# EAGLE design automatic streetlight with LDR (EAGLE 7.2.0)
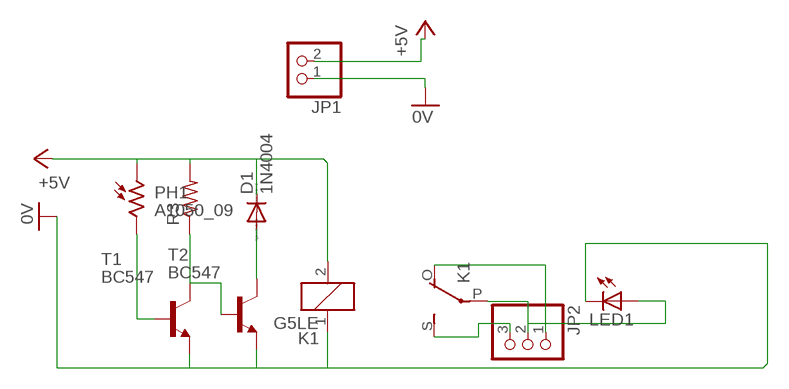
[diagram p0: schematic, sheet 1]

## Parts
D1  1N4004  [DO41-10]
JP1  PINHD-1X2  [1X02]
JP2  PINHD-1X3  [1X03]
K1  G5LE  [G5LE]
LED1  LED3MM  [LED3MM]
PH1  A1050_09  [T0-46-A10XX]
R3  R-US_0207/10  [0207/10]
T1  BC547  [TO92]
T2  BC547  [TO92]

## Nets
0V: JP1.1 K1.1 LED1.K(C) T1.1(E) T2.1(E)
+5V: D1.C JP1.2 K1.2 PH1.1 R3.2
N$2: PH1.2 T1.2(B)
N$3: JP2.2 K1.P(2:P) LED1.A
N$5: JP2.1 K1.O(2:O)
N$6: JP2.3 K1.S(2:S)
N$7: R3.1 T1.3(C) T2.2(B)
N$8: D1.A T2.3(C)

## Library data of the parts
D1 = diode:1N4004: DIODE general purpose rectifier, 1 A
JP1 = pinhead:PINHD-1X2: PIN HEADER
JP2 = pinhead:PINHD-1X3: PIN HEADER
K1 = relay:G5LE: RELAY 1 x switch, 10 A/120 V AC, 8 A/30 V DC, Omron; OC_FARNELL: unknown; OC_NEWARK: unknown
LED1 = led:LED: LED OSRAM: - CHIPLED LG R971, LG N971, LY N971, LG Q971, LY Q971, LO R971, LY R971 LH N974, LH R974 LS Q976, LO Q976, LY Q976 LO Q996 - Hyper CHIPLED LW Q18S LB Q993, LB Q99A, LB R99A - SideLED LS A670, LO A670, LY A670, LG A670, LP A670 LB A673, LV A673, LT A673, LW A673 LH A674 LY A675 LS A676, LA A676, LO A676, LY A676, LW A676 LS A679, LY A679, LG A679 - Hyper Micro SIDELED® LS Y876, LA Y876, LO Y876, LY Y876 LT Y87S - SmartLED LW L88C, LW L88S LB L89C, LB L89S, LG L890 LS L89K, LO L89K, LY L89K LS L896, LA L896, LO L896, LY L896 - TOPLED LS T670, LO T670, LY T670, LG T670, LP T670 LSG T670, LSP T670, LSY T670, LOP T670, LYG T670 LG T671, LOG T671, LSG T671 LB T673, LV T673, LT T673, LW T673 LH T674 LS T676, LA T676, LO T676, LY T676, LB T676, LH T676, LSB T676, LW T676 LB T67C, LV T67C, LT T67C, LS T67K, LO T67K, LY T67K, LW E67C LS E67B, LA E67B, LO E67B, LY E67B, LB E67C, LV E67C, LT E67C LW T67C LS T679, LY T679, LG T679 LS T770, LO T770, LY T770, LG T770, LP T770 LB T773, LV T773, LT T773, LW T773 LH T774 LS E675, LA E675, LY E675, LS T675 LS T776, LA T776, LO T776, LY T776, LB T776 LHGB T686 LT T68C, LB T68C - Hyper Mini TOPLED® LB M676 - Mini TOPLED Santana® LG M470 LS M47K, LO M47K, LY M47K Source: http://www.osram.convergy.de LUXEON: - LUMILED® LXK2-PW12-R00, LXK2-PW12-S00, LXK2-PW14-U00, LXK2-PW14-V00 LXK2-PM12-R00, LXK2-PM12-S00, LXK2-PM14-U00 LXK2-PE12-Q00, LXK2-PE12-R00, LXK2-PE12-S00, LXK2-PE14-T00, LXK2-PE14-U00 LXK2-PB12-K00, LXK2-PB12-L00, LXK2-PB12-M00, LXK2-PB14-N00, LXK2-PB14-P00, LXK2-PB14-Q00 LXK2-PR12-L00, LXK2-PR12-M00, LXK2-PR14-Q00, LXK2-PR14-R00 LXK2-PD12-Q00, LXK2-PD12-R00, LXK2-PD12-S00 LXK2-PH12-R00, LXK2-PH12-S00 LXK2-PL12-P00, LXK2-PL12-Q00, LXK2-PL12-R00 Source: www.luxeon.com KINGBRIGHT: KA-3528ASYC Source: www.kingbright.com
PH1 = photo-elements:A10: Sensor Robust Light Sensing Applications Outdoor Light Sensing Application Source: http://optoelectronics.perkinelmer.com/content/Datasheets/DTS_PhotocellsA1050.pdf
R3 = rcl:R-US_: RESISTOR, American symbol
T1 T2 = transistor:BC547: NPN TRANSISTOR

## Board
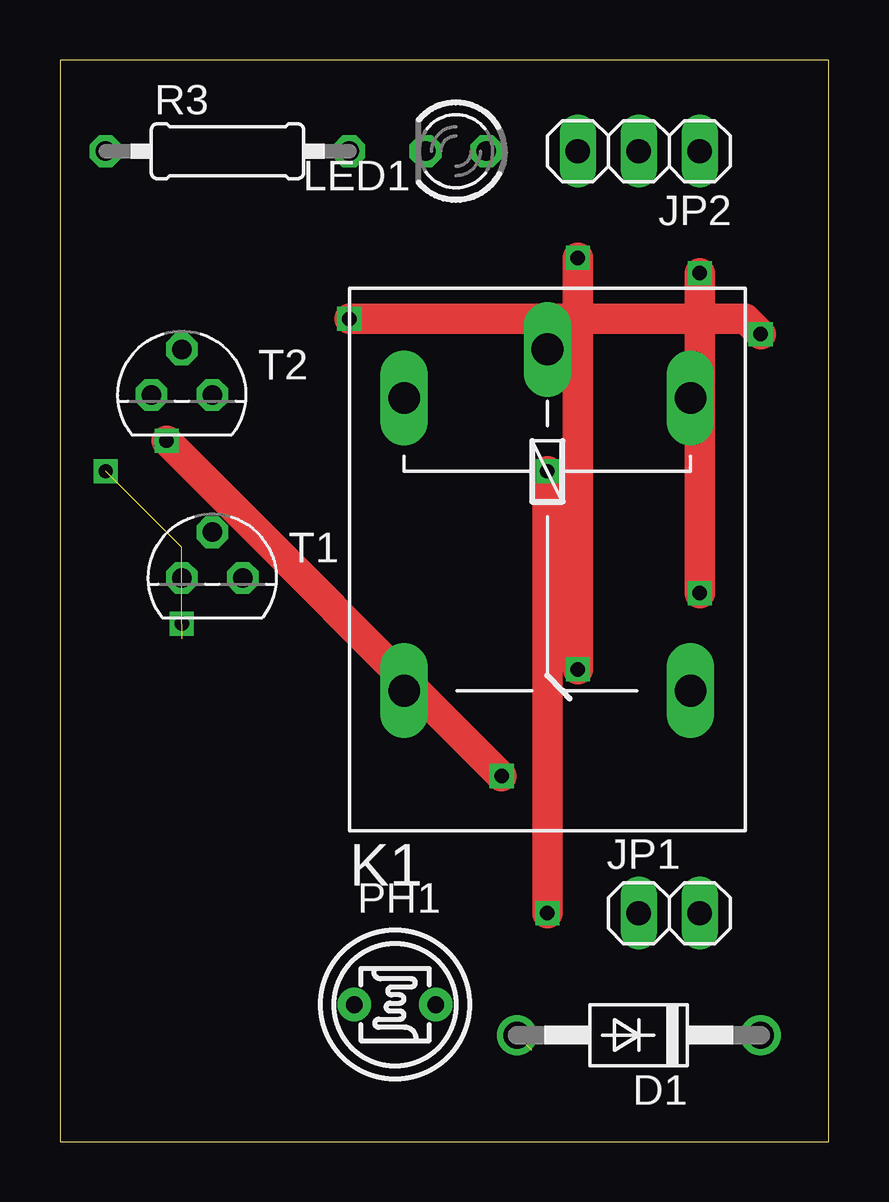
[diagram p1: board, top side]
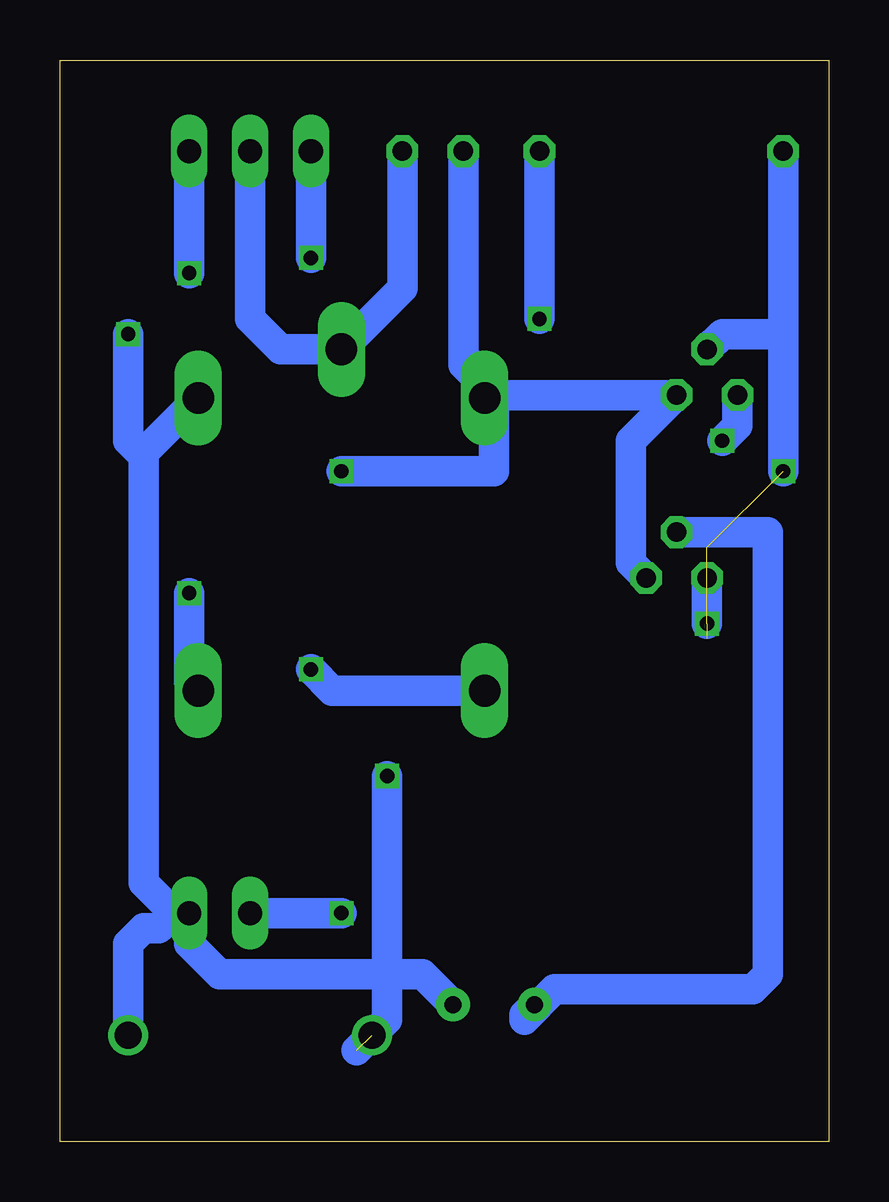
[diagram p2: board, bottom side, seen from below]

Size 32.05 x 45.08 mm. Coordinates in mm from the lower left corner, seen from the top.
Outline: 0,0 32.05,0 32.05,45.08 0,45.08 0,0
Copper layers (1*16): Top 0.035mm / dielectric 1.5mm / Bottom 0.035mm
Design rules "default": minimum track width 10mil, minimum drill 24mil, track to track 8mil, track to pad 8mil, pad to pad 8mil, via to via 8mil, smd to smd 8mil, copper to edge 40mil, drill to drill 8mil, minimum pad ring 10mil, minimum via ring 8mil, stop-mask expansion 4mil, vias tented up to drill 0mil, thermal gap 10mil

### Footprints (pad centres in the part's own frame; a part is rotated, then mirrored left to right if it is on the bottom)
DO41-10 = drill 1.118: A 5.08,0; C -5.08,0
1X02 = drill 1.016 long: 1 -1.27,0; 2 1.27,0
1X03 = drill 1.016 long: 1 -2.54,0; 2 0,0; 3 2.54,0
G5LE = drill 1.321 long: 1 -7.493,-5.969; 2 -7.493,5.969; O 4.699,5.969; P -9.525,0; S 4.699,-5.969
LED3MM = drill 0.813 octagon: A -1.27,0; K 1.27,0
T0-46-A10XX = drill 0.7 pad 1.4: 1 -1.7,0; 2 1.7,0
0207/10 = drill 0.813 octagon: 1 -5.08,0; 2 5.08,0
TO92 = drill 0.813 octagon: 1 1.27,0; 2 0,1.905; 3 -1.27,0

### Placement (x,y rotation side)
D1  24.13,4.45 180 top
JP1  25.4,9.53 0 top
JP2  24.13,41.27 180 top
K1  20.32,23.5 270 top
LED1  16.51,41.27 180 top
PH1  13.97,5.72 180 top
R3  6.98,41.27 0 top
T1  6.35,23.5 0 top
T2  5.08,31.12 0 top

### Tracks (layer width: path | path; a pad name or v marks a point on that pad's centre or on a via)
0V  (via drill 0.6)
  Top 1.27: v20.32,9.53 v20.32,27.94
  Bottom 1.27: K1.1 14.22,31.12 T2.1 8.26,29.21 8.26,24.13 T1.1 | LED1.K 15.24,32.39 14.6,31.75 14.6,31.24 K1.1 | JP1.1 v20.32,9.53 | v20.32,27.94 13.97,27.94 13.97,30.61 K1.1
+5V  (via drill 0.6)
  Top 1.27: v12.06,34.29 28.58,34.29 v29.21,33.66
  Bottom 1.27: 27.3,9.53 JP1.2 26.67,8.26 25.4,6.99 16.94,6.99 PH1.1 | 27.3,9.53 28.58,10.8 28.58,28.58 | 28.58,28.58 28.58,28.7 K1.2 | D1.C 29.21,8.26 28.58,8.89 27.94,8.89 27.3,9.53 | R3.2 v12.06,34.29 | v29.21,33.66 29.21,29.21 28.58,28.58
N$2
  Bottom 1.27: T1.2 2.54,25.4 2.54,6.99 3.17,6.35 11.43,6.35 12.7,5.08 12.7,5.29 PH1.2
N$3
  Bottom 1.27: JP2.2 24.13,34.29 22.86,33.02 K1.P 17.78,35.56 LED1.A
N$5  (via drill 0.6)
  Top 1.27: v26.67,36.2 v26.67,22.86
  Bottom 1.27: JP2.1 v26.67,36.2 | v26.67,22.86 26.67,19.18 K1.O
N$6  (via drill 0.6)
  Top 1.27: v21.59,19.69 v21.59,36.83
  Bottom 1.27: K1.S 20.7,18.8 v21.59,19.69 | v21.59,36.83 JP2.3
N$7  (via drill 0.6)  (3 unrouted)
  Bottom 1.27: R3.1 1.91,33.66 | 1.91,33.66 4.45,33.66 T2.2 | T1.3 v5.08,21.59 | v1.91,27.94 1.91,33.66
N$8  (via drill 0.6)  (1 unrouted)
  Top 1.27: v4.45,29.21 v18.41,15.24
  Bottom 1.27: T2.3 3.81,29.84 v4.45,29.21 | v18.41,15.24 18.41,5.08 19.69,3.81